# EAGLE design pwr_supply_board (EAGLE 7.5.0)
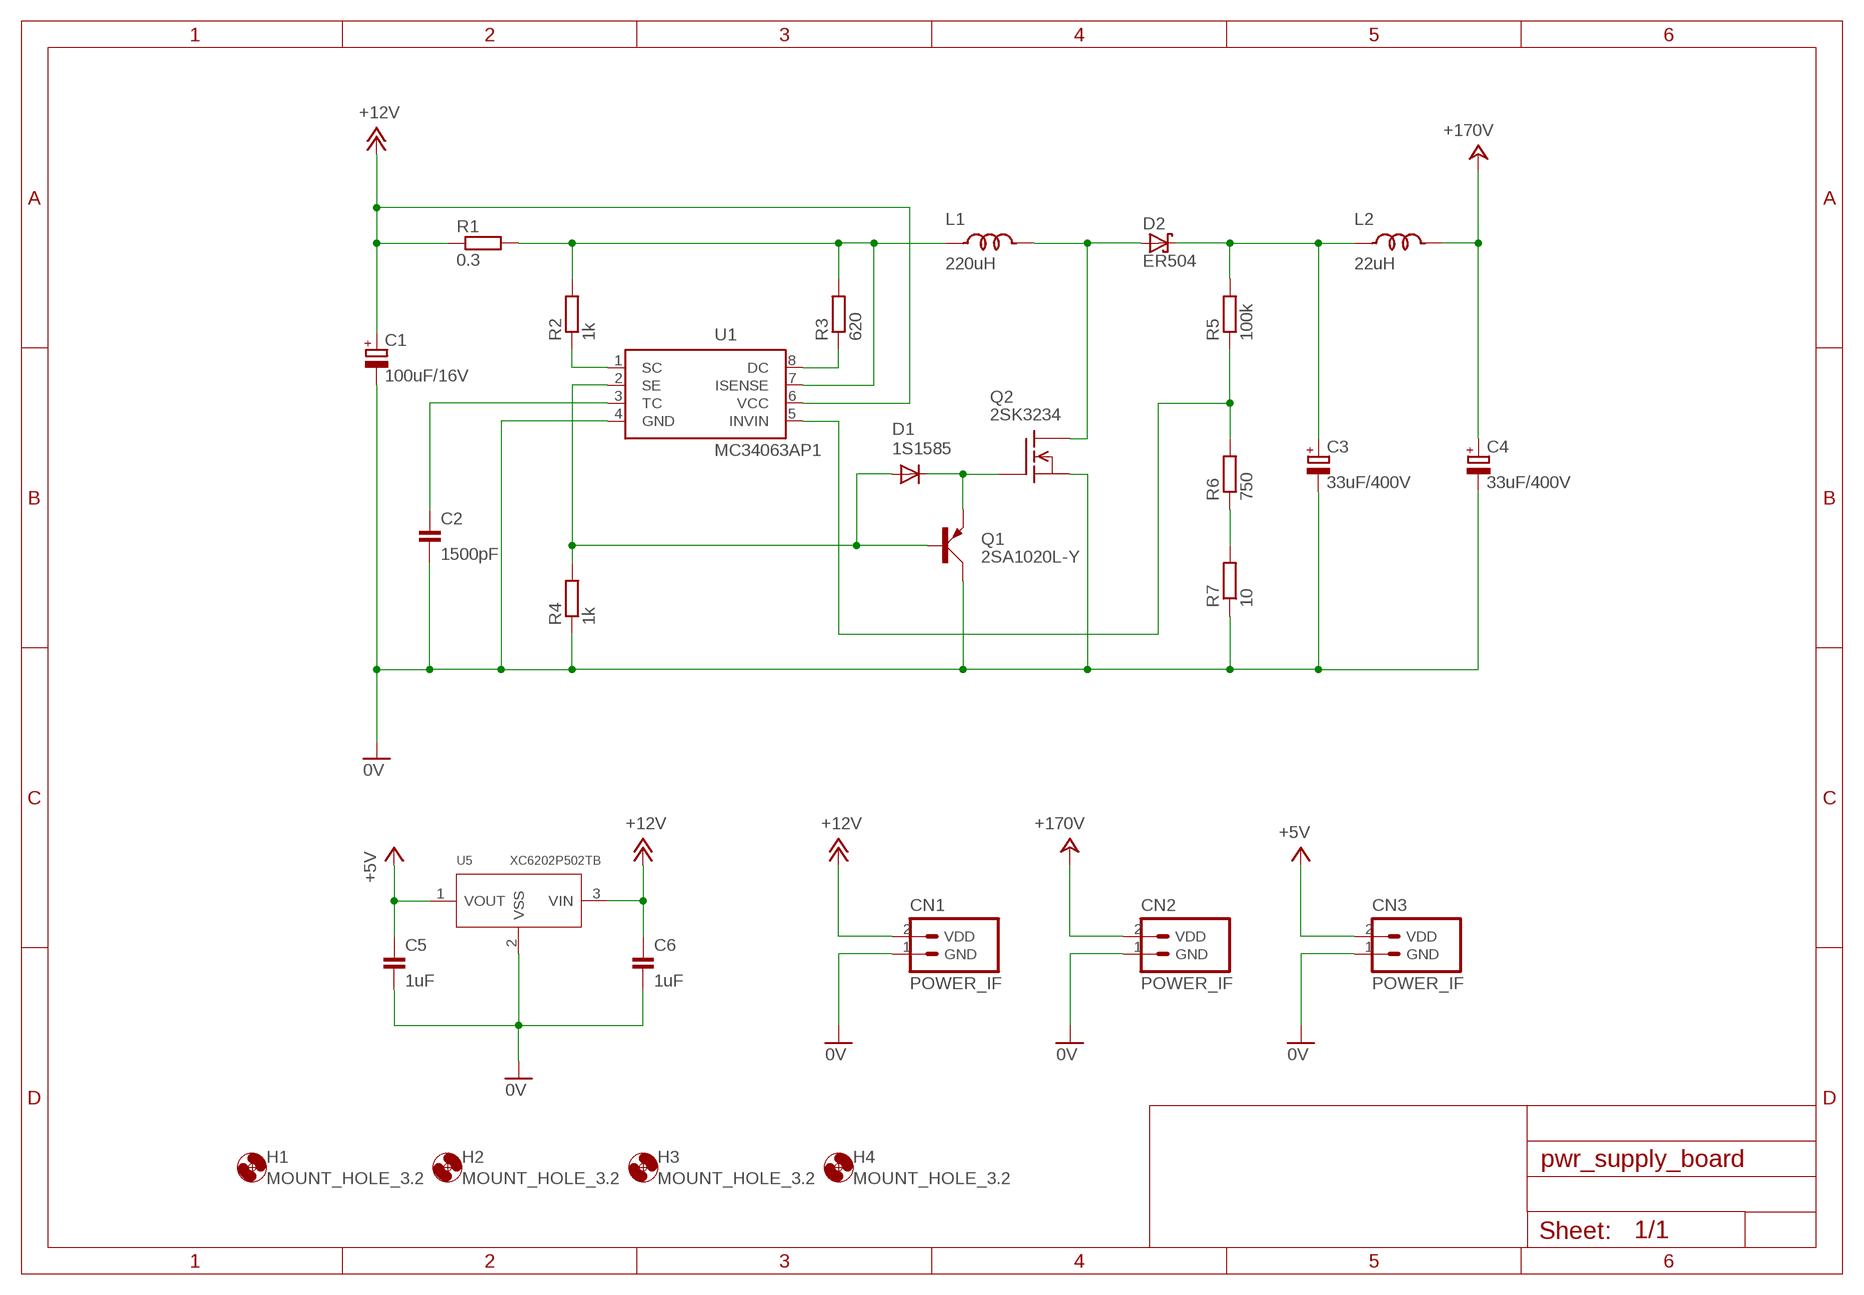
[diagram p0: schematic, sheet 1]

## Parts
C1  100uF/16V  ELECAP_100MIL  [ELECAP_100MIL]
C2  1500pF  CAP_100MIL  [CAP_100MIL]
C3  33uF/400V  ELECAP_300MIL  [ELECAP_300MIL]
C4  33uF/400V  ELECAP_300MIL  [ELECAP_300MIL]
C5  1uF  CAP_100MIL  [CAP_100MIL]
C6  1uF  CAP_100MIL  [CAP_100MIL]
CN1  POWER_IF  [HEADER_2PIN_POWER_IF]
CN2  POWER_IF  [HEADER_2PIN_POWER_IF]
CN3  POWER_IF  [HEADER_2PIN_POWER_IF]
D1  1S1585  [DIODE-200MIL]
D2  ER504  [DIODE-500MIL]
H1  MOUNT_HOLE_3.2  [3,2]
H2  MOUNT_HOLE_3.2  [3,2]
H3  MOUNT_HOLE_3.2  [3,2]
H4  MOUNT_HOLE_3.2  [3,2]
L1  220uH  TC5026-220UH-050  [TOROID_COIL-300MIL]
L2  22uH  TC5026-22UH-060  [TOROID_COIL-300MIL]
Q1  2SA1020L-Y  [TO-92NL]
Q2  2SK3234  [TO-220]
R1  0.3  RESISTOR_600MIL  [RESISTOR_0411_600MIL]
R2  1k  RESISTOR_600MIL  [RESISTOR_0411_600MIL]
R3  620  RESISTOR_600MIL  [RESISTOR_0411_600MIL]
R4  1k  RESISTOR_600MIL  [RESISTOR_0411_600MIL]
R5  100k  RESISTOR_600MIL  [RESISTOR_0411_600MIL]
R6  750  RESISTOR_600MIL  [RESISTOR_0411_600MIL]
R7  10  RESISTOR_600MIL  [RESISTOR_0411_600MIL]
U1  MC34063AP1  [DIL08]
U5  XC6202P502TB  [TO92-LINE]

## Nets
0V: C1.- C2.2 C3.- C4.- C5.2 C6.2 CN1.1(GND) CN2.1(GND) CN3.1(GND) Q1.2(C) Q2.3(S) R4.1 R7.1 U1.4(GND) U5.2(VSS)
+5V: C5.1 CN3.2(VDD) U5.1(VOUT)
+12V: C1.+ C6.1 CN1.2(VDD) R1.1 U1.6(VCC) U5.3(VIN)
+24V: C4.+ CN2.2(VDD) L2.2 ; supply symbol labelled +170V
N$1: R3.1 U1.8(DC)
N$2: C3.+ D2.C L2.1 R5.2
N$3: C2.1 U1.3(TC)
N$4: R2.1 U1.1(SC)
N$5: L1.1 R1.2 R2.2 R3.2 U1.7(ISENSE)
N$6: R5.1 R6.2 U1.5(INVIN)
N$7: D1.A Q1.3(B) R4.2 U1.2(SE)
N$8: D1.C Q1.1(E) Q2.1(G)
N$9: R6.1 R7.2
N$10: D2.A L1.2 Q2.2(D)

## Library data of the parts
C1 C3 C4 = Parts:ELECAP: 電解コンデンサー
C2 C5 C6 = Parts:CAP: コンデンサー
CN1-CN3 = PartsForProto:POWER_IF: 電源供給インターフェース
D1 = Parts:1S1585: 汎用小信号ダイオード ◆電気的特性 ・順電圧（ＶF）：１．０Ｖ＠ＩF＝１００ｍＡ ・逆電流（ＩR）：０．５μＡ＠ＶR＝８０Ｖ ・端子間容量ＣT）：２ｐＦ＠ＶR＝０Ｖ、１ＭＨｚ ・逆回復時間(ｔrr)：２ｎＳ＠ＶR＝６Ｖ、ＩF＝１０ｍＡ、ＲL＝１００Ω
D2 = Parts:ER504: ファストリカバリ・ダイオード ・耐圧：４００Ｖ ・電流：５Ａ ・ＶＦ：１．２５Ｖ（＠５Ａ） ・Ｉｒ：５μＡ（＠２５℃） ・回復時間（Ｔｒｒ）：３５ｎｓ ・接合容量：６５ｐＦ
H1-H4 = Generic:MOUNT_HOLE
L1 = Parts:TC5026-220UH-050: 電力用インダクタ 公称インダクタンス：220μH±10％ （＠1KHz/0.25V） 定格電流：5A 寸法：φD=15、H=7、φd=0.5、L=10（単位：mm）
L2 = Parts:TC5026-22UH-060: 電力用インダクタ 公称インダクタンス：22μH±10％ （＠1KHz/0.25V） 直流抵抗：650mΩ 定格電流：6A 寸法：φD=15、H=6.5、φd=0.6、L=8（単位：mm）
Q1 = Parts:2SA1020L: シリコンＰＮＰエピタキシャルトランジスタ ・ＶＣＢＯ：－５０Ｖ ・ＶＣＥＯ：－５０Ｖ ・ＶＥＢＯ：－５Ｖ ・ＩＣ：－２Ａ ・ＰＣ：９００ｍＷ（ＴＡ＝２５℃） ・パッケージ：ＴＯ－９２（ＥＣＢ）
Q2 = Parts:2SK3234: Ｎチャンネル高耐圧パワーＭＯＳＦＥＴ ■電源，ＤＣ－ＤＣコンバータ向け ・耐圧（ＶＤＳＳ）：５００Ｖ ・ＩＤ＝８Ａ ・低オン抵抗：ＲＤＳ＝０．６５Ω ・スイッチングスピード：ｔｆ＝２５ｎｓ
R1-R7 = Parts:RESISTOR: 抵抗器
U1 = Parts:MC34063A*: DC/DCスイッチングレギュレータ ■生産中止品 ■スイッチ電流: 1.5A (MAX) ■発振周波数: 100kHz ■過電流検出回路内蔵 ■電源電圧: 3V~40V ■出力電圧 :1.25V~40V ■動作温度 : 0°C～70°C
U5 = Parts:XC6202*: 低損失ＣＭＯＳ三端子レギュレーター ・定格出力：５Ｖ ・最大出力電流：１５０ｍＡ以上 ・入力最大電圧：２０Ｖ ・入出力電圧差： ０．２Ｖ（３０ｍＡ時） ０．６７Ｖ（１００ｍＡ時） ・低消費電流：１０μＡ

## Board
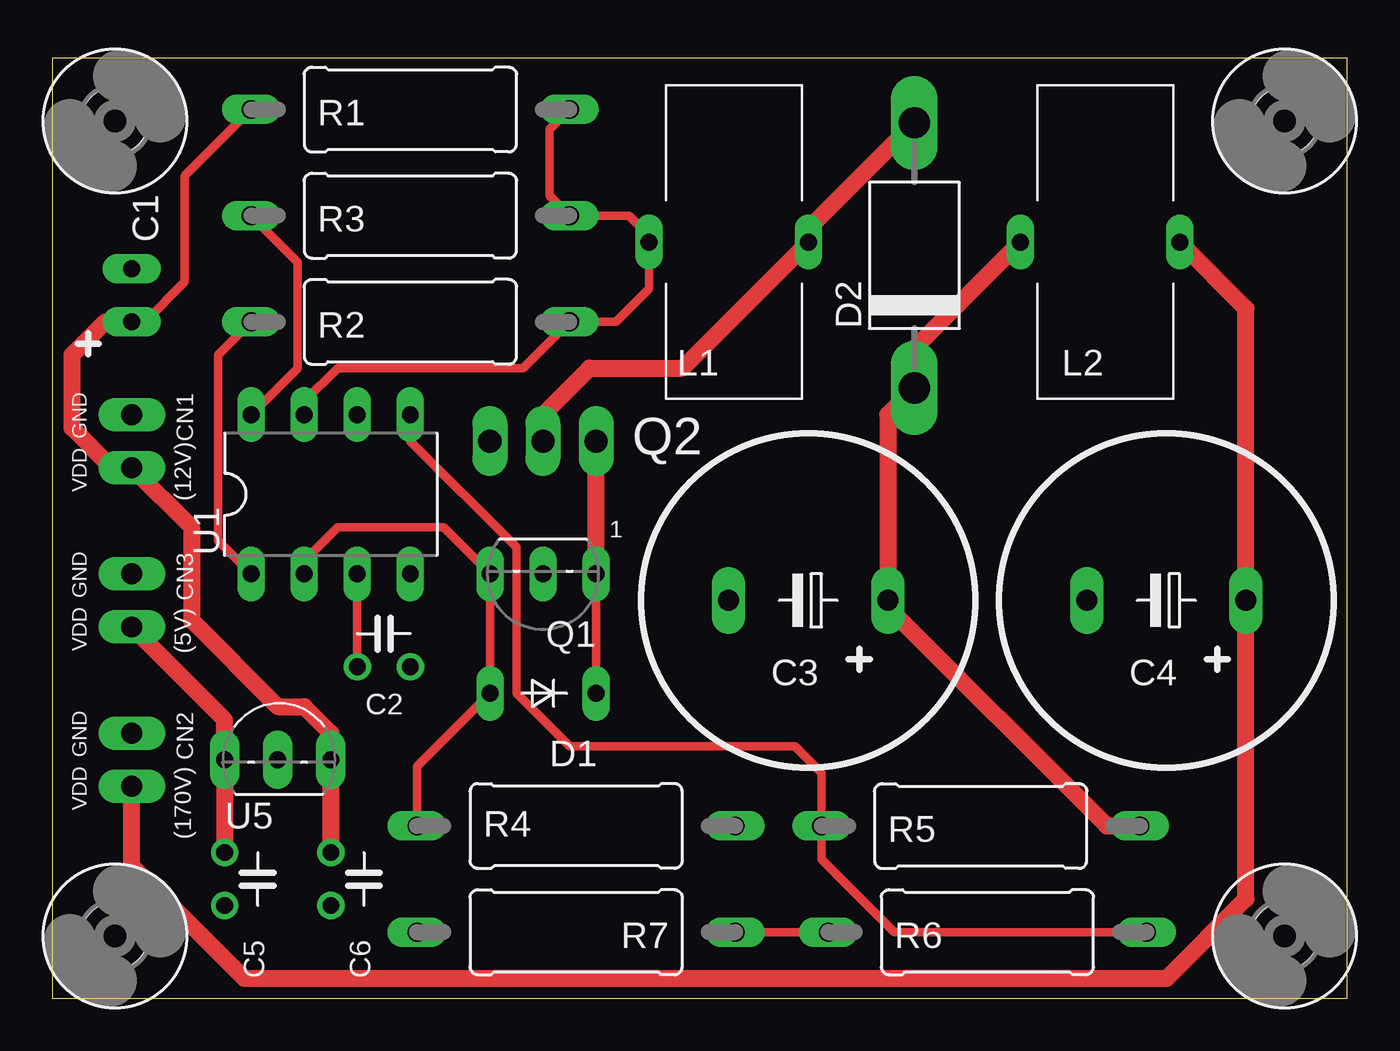
[diagram p1: board, top side]
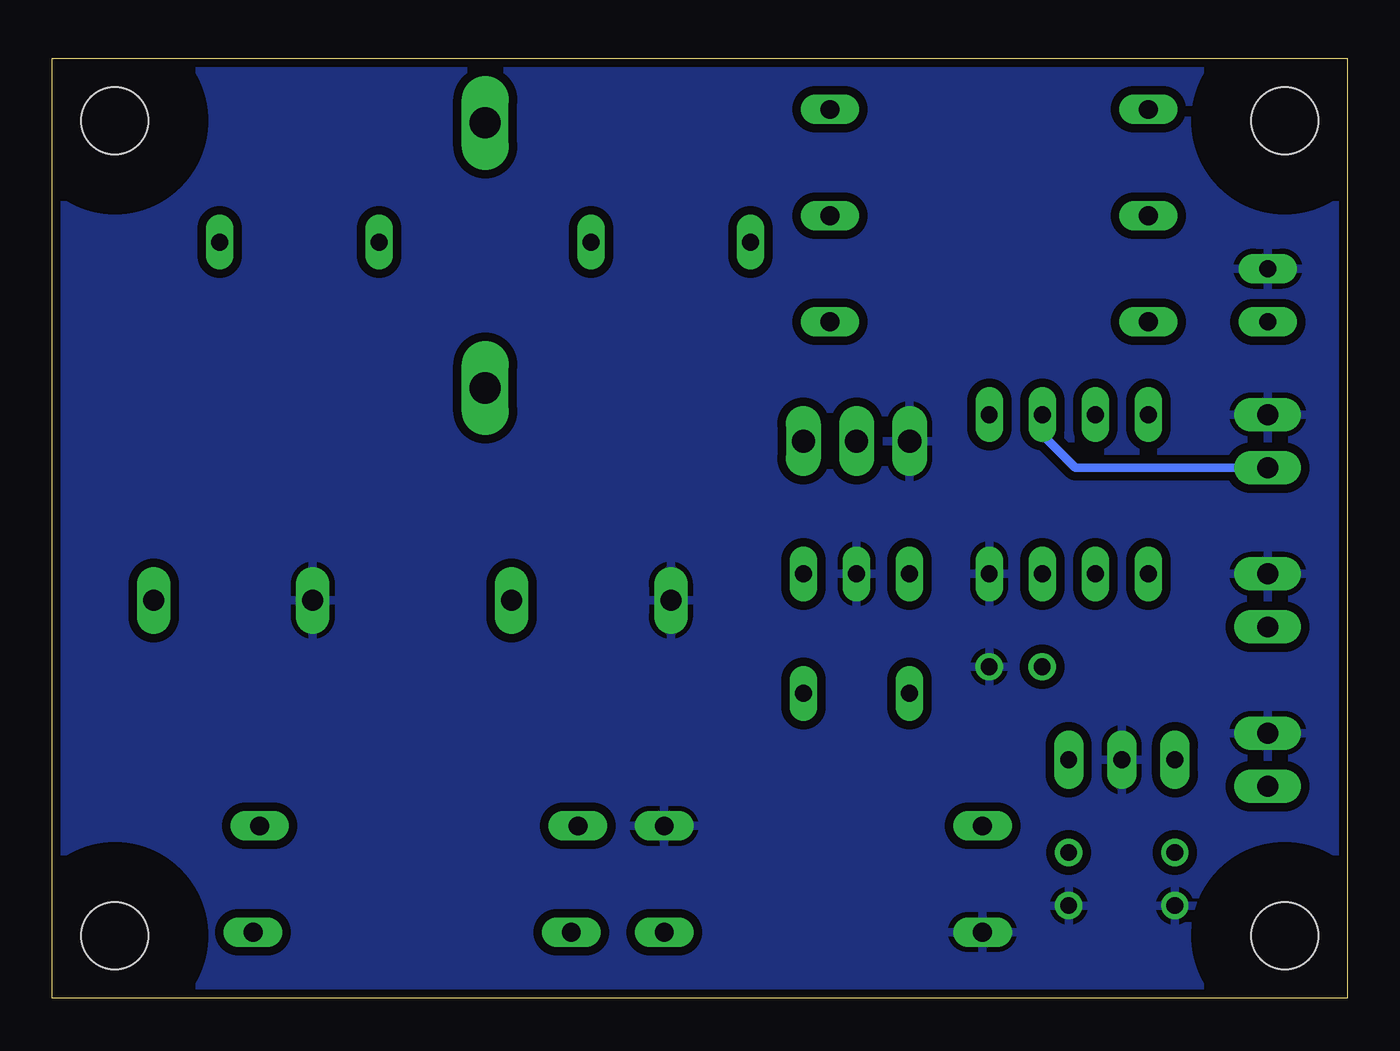
[diagram p2: board, bottom side, seen from below]

Size 62 x 45 mm. Coordinates in mm from the lower left corner, seen from the top.
Outline: 0,0 62,0 62,45 0,45 0,0
Copper layers (1*16): Top 0.035mm / dielectric 1.5mm / Bottom 0.035mm
Design rules "SeeedStudio_2layer_DRU_no_angle_20140221": minimum track width 6mil, minimum drill 12mil, track to track 6mil, track to pad 6mil, pad to pad 6mil, via to via 6mil, smd to smd 0mil, copper to edge 10mil, drill to drill 10mil, minimum pad ring 10mil, minimum via ring 6mil, stop-mask expansion 2mil, vias tented up to drill 100mil, thermal gap 10mil

### Footprints (pad centres in the part's own frame; a part is rotated, then mirrored left to right if it is on the bottom)
ELECAP_100MIL = drill 0.8 pad 1.4 long: + -1.27,0; - 1.27,0
CAP_100MIL = drill 0.8: 1 -1.27,0; 2 1.27,0
ELECAP_300MIL = drill 1 pad 1.6 long: + -3.81,0; - 3.81,0
HEADER_2PIN_POWER_IF = drill 1 pad 1.6 long: 1 0,0; 2 2.54,0
DIODE-200MIL = drill 0.813 long: A 2.54,0; C -2.54,0
DIODE-500MIL = drill 1.5 long: A 12.7,0; C 0,0
3,2 = hole 3.2: 0,0
TOROID_COIL-300MIL = drill 0.813 long: 1 -3.81,0; 2 3.81,0
TO-92NL = drill 0.813 long: 1 0,0; 2 2.54,0; 3 5.08,0
TO-220 = drill 1.118 long: 1 0,0; 2 2.54,0; 3 5.08,0
RESISTOR_0411_600MIL = drill 0.9 long: 1 -7.62,0; 2 7.62,0
DIL08 = drill 0.813 long: 1 -3.81,-3.81; 2 -1.27,-3.81; 3 1.27,-3.81; 4 3.81,-3.81; 5 3.81,3.81; 6 1.27,3.81; 7 -1.27,3.81; 8 -3.81,3.81
TO92-LINE = drill 0.8 pad 1.4 long: 1 0,0; 2 2.54,0; 3 5.08,0

### Placement (x,y rotation side)
C1  3.81,33.66 90 top
C2  15.88,15.88 0 top
C3  36.2,19.05 180 top
C4  53.34,19.05 180 top
C5  8.26,5.71 270 top
C6  13.34,5.71 270 top
CN1  3.81,27.94 270 top
CN2  3.81,12.7 270 top
CN3  3.81,20.32 270 top
D1  23.5,14.61 180 top
D2  41.27,29.21 90 top
H1  3,42 0 top
H2  59,42 0 top
H3  59,3 0 top
H4  3,3 0 top
L1  32.38,36.2 0 top
L2  50.16,36.2 0 top
Q1  26.04,20.32 180 top
Q2  26.04,26.67 180 top
R1  17.14,42.55 0 top
R2  17.14,32.38 0 top
R3  17.14,37.47 0 top
R4  25.08,8.26 180 top
R5  44.45,8.26 0 top
R6  44.77,3.17 0 top
R7  25.08,3.17 0 top
U1  13.34,24.13 0 top
U5  8.26,11.43 0 top

### Tracks (layer width: path | path; a pad name or v marks a point on that pad's centre or on a via)
0V
  pour Bottom (isolate 0.406, rank 3): -2.54,46.99 64.77,46.99 64.77,-1.27 -2.54,-1.27
+5V
  Top 0.813: CN3.2 8.26,13.34 U5.1 C5.1
+12V
  Top 0.406: R1.1 6.35,39.37 6.35,34.29 4.45,32.38 C1.+
  Top 0.813: C6.1 U5.3 13.34,12.7 12.06,13.97 10.79,13.97 6.67,18.1 6.67,22.54 CN1.2 2.86,25.4 0.95,27.3 0.95,30.8 2.54,32.38 C1.+
  Bottom 0.406: U1.6 14.61,26.99 13.02,25.4 CN1.2
+24V
  Top 0.813: L2.2 57.15,33.02 C4.+ 57.15,4.76 53.34,0.95 9.21,0.95 3.81,6.35 CN2.2
N$1
  Top 0.406: R3.1 11.75,35.24 11.75,30.16 U1.8
N$2
  Top 0.813: L2.1 41.27,31.11 D2.C 40.01,27.94 C3.+ 40.01,18.73 50.48,8.26 R5.2
N$3
  Top 0.406: U1.3 C2.1
N$4
  Top 0.406: U1.1 7.94,21.91 7.94,30.8 R2.1
N$5
  Top 0.406: U1.7 12.06,28.57 13.65,30.16 22.54,30.16 R2.2 26.99,32.38 28.57,33.97 L1.1 28.57,36.51 27.62,37.47 R3.2 23.81,38.42 23.81,41.59 R1.2
N$6
  Top 0.406: R6.2 40.32,3.17 36.83,6.67 R5.1 36.83,10.79 35.56,12.06 24.77,12.06 22.23,14.61 22.23,21.59 17.14,26.67 U1.5
N$7
  Top 0.406: U1.2 12.06,20.95 13.65,22.54 18.73,22.54 Q1.3 D1.A 17.46,11.11 R4.2
N$8
  Top 0.406: D1.C Q1.1
  Top 0.813: Q1.1 Q2.1
N$9
  Top 0.406: R7.2 R6.1
N$10
  Top 0.813: D2.A 36.2,36.83 L1.2 30.16,30.16 25.72,30.16 23.5,27.94 Q2.2

### Text on the board
tPlace: (12V) | (5V) | (170V)